# EasyEDA schematic SCH_STEMI_XB3.0_LneFollower_2023-01-25.json
TITLE: STEMI XB3.0; REV: 1.0; Date: 2019-07-29; Sheet: 1/1; Drawn By: MAYADI; Company: STEMI ROBOTIKA
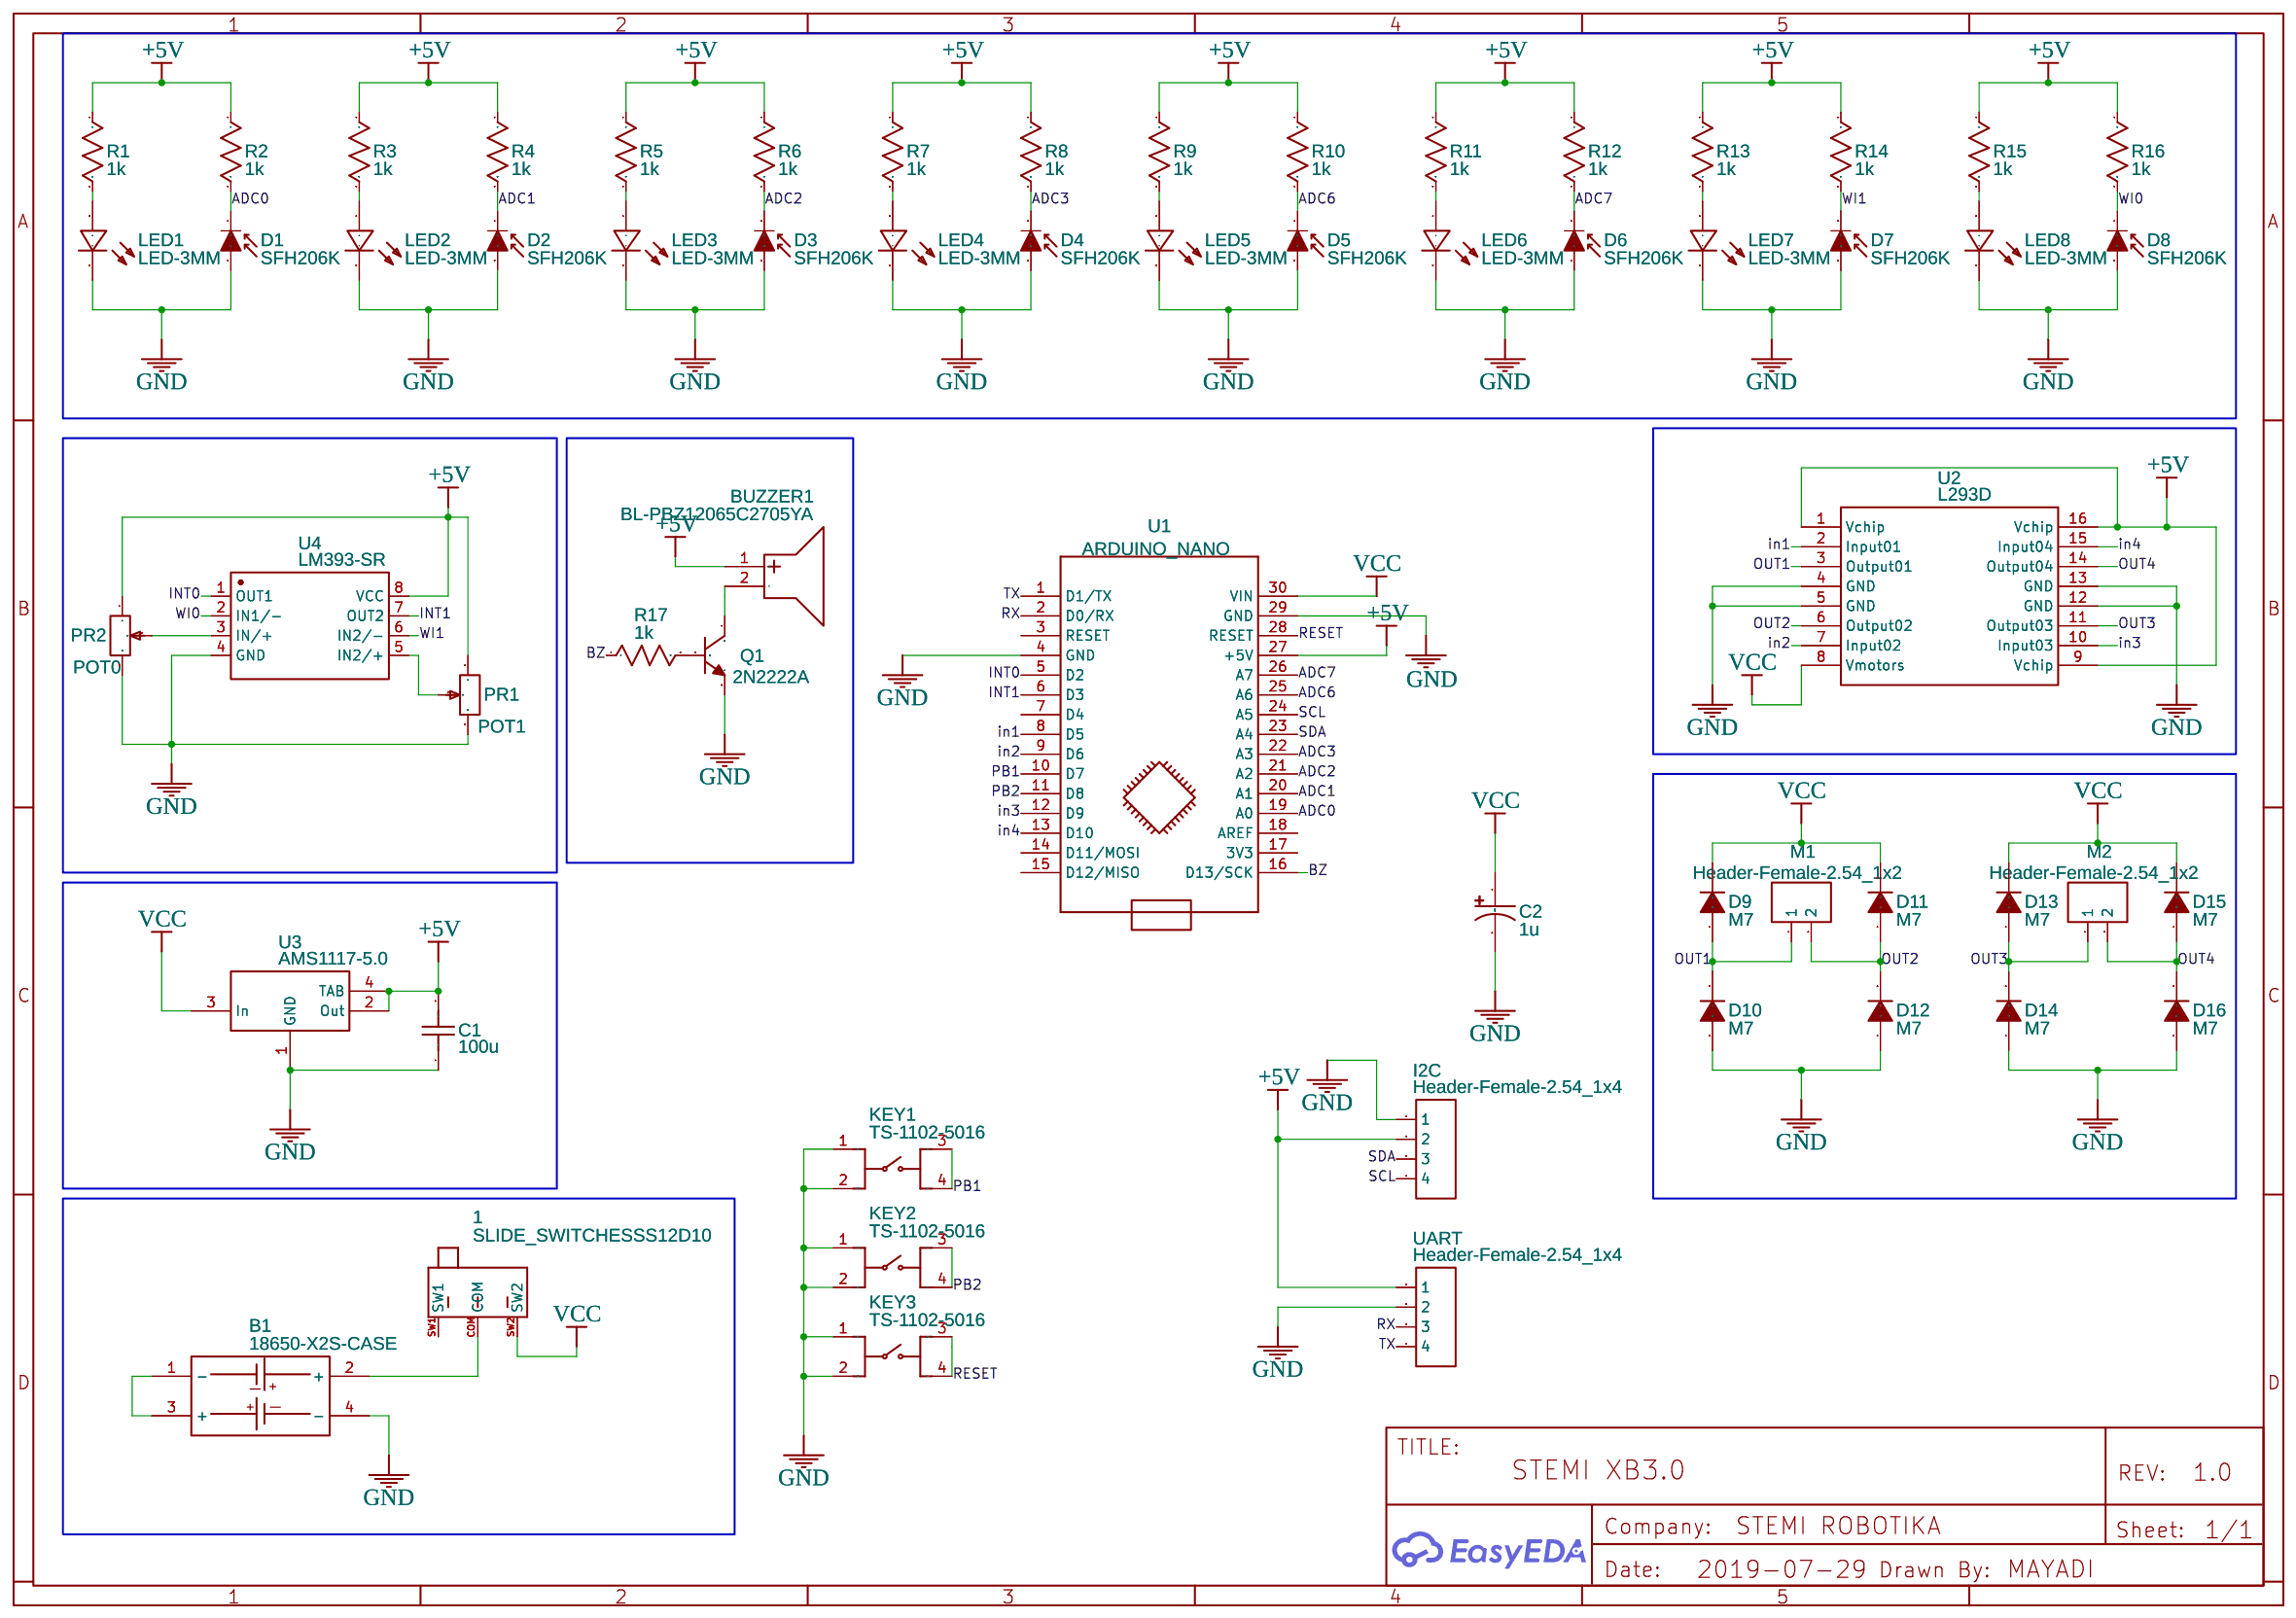
[diagram p0: schematic sheet]

## Parts
1  SLIDE_SWITCHESSS12D10  [SS12D10]
B1  18650-X2S-CASE  [18650-X2S]
BUZZER1  BL-PBZ12065C2705YA  [BUZZER-R6.0-2P-6.5PITCH]
C1  100u  [1206]
C2  1u  [CAP-D6.3XF2.5]
D1  SFH206K  [PHOTODIODE_SFH225]
D2  SFH206K  [PHOTODIODE_SFH225]
D3  SFH206K  [PHOTODIODE_SFH225]
D4  SFH206K  [PHOTODIODE_SFH225]
D5  SFH206K  [PHOTODIODE_SFH225]
D6  SFH206K  [PHOTODIODE_SFH225]
D7  SFH206K  [PHOTODIODE_SFH225]
D8  SFH206K  [PHOTODIODE_SFH225]
D9  M7  [SMB(DO-214AA)]
D10  M7  [SMB(DO-214AA)]
D11  M7  [SMB(DO-214AA)]
D12  M7  [SMB(DO-214AA)]
D13  M7  [SMB(DO-214AA)]
D14  M7  [SMB(DO-214AA)]
D15  M7  [SMB(DO-214AA)]
D16  M7  [SMB(DO-214AA)]
I2C  Header-Female-2.54_1x4  [HDR-4X1/2.54]
KEY1  TS-1102-5016  [KEY-6.0*6.0-2]
KEY2  TS-1102-5016  [KEY-6.0*6.0-2]
KEY3  TS-1102-5016  [KEY-6.0*6.0-2]
LED1  LED-3MM  [LED-3MM/2.54]
LED2  LED-3MM  [LED-3MM/2.54]
LED3  LED-3MM  [LED-3MM/2.54]
LED4  LED-3MM  [LED-3MM/2.54]
LED5  LED-3MM  [LED-3MM/2.54]
LED6  LED-3MM  [LED-3MM/2.54]
LED7  LED-3MM  [LED-3MM/2.54]
LED8  LED-3MM  [LED-3MM/2.54]
M1  Header-Female-2.54_1x2  [HDR-1X2/2.54]
M2  Header-Female-2.54_1x2  [HDR-1X2/2.54]
PR1  POT1  [RES-ADJ_3296W]
PR2  POT0  [RES-ADJ_3296W]
Q1  2N2222A  [TO-92(TO-92-3F)-2.54]
R1  1k  [AXIAL-0.4]
R2  1k  [AXIAL-0.4]
R3  1k  [AXIAL-0.4]
R4  1k  [AXIAL-0.4]
R5  1k  [AXIAL-0.4]
R6  1k  [AXIAL-0.4]
R7  1k  [AXIAL-0.4]
R8  1k  [AXIAL-0.4]
R9  1k  [AXIAL-0.4]
R10  1k  [AXIAL-0.4]
R11  1k  [AXIAL-0.4]
R12  1k  [AXIAL-0.4]
R13  1k  [AXIAL-0.4]
R14  1k  [AXIAL-0.4]
R15  1k  [AXIAL-0.4]
R16  1k  [AXIAL-0.4]
R17  1k  [AXIAL-0.4]
U1  ARDUINO_NANO  [ARDUINO_NANO]
U2  L293D  [MCP3008-IP]
U3  AMS1117-5.0  [SOT-223]
U4  LM393-SR  [SOIC-8_150MIL]
UART  Header-Female-2.54_1x4  [HDR-4X1/2.54]

## Library data of the parts
1 = -: Contributor: Thore Krug; Manufacturer Part: ?
B1 = -: Contributor: pyfa1992
BUZZER1 = -: Supplier: LCSC; Supplier Part: C249440; Manufacturer: Dongguan Bolin Elec; Contributor: LCSC
C1 = Cap_1206_US: Manufacturer Part: ?
C2 = Cap_Electrolytic(TH)_D6.3XF2.5_US: Manufacturer Part: ?
D1-D8 = -: Contributor: KiCAD; license: https://www.gnu.org/licenses/lgpl-2.1.html; Manufacturer Part: ?
D9-D16 = -: Supplier Part: undefined; Supplier: LCSC; Manufacturer: LCSC
I2C UART = -: Supplier: LCSC; Manufacturer: ReliaPro; Supplier Part: C124413
KEY1-KEY3 = -: Supplier: LCSC; Manufacturer: SOFNG; Contributor: EasyEDA; Supplier Part: C111609
LED1-LED8 = -: Supplier: LCSC; Manufacturer: EVERLIGHT; Manufacturer Part: 204-10SURD/S530-A3; Supplier Part: C99772
M1 M2 = -: Supplier: LCSC; Manufacturer: BOOMELE; Manufacturer Part: 2.54-1*2PFemale; image: //image.lceda.cn/szlcsc/C49661.jpg; Supplier Part: C49661
PR1 PR2 = -: Supplier Part: C62174; Supplier: LCSC; Manufacturer: ReliaPro; Manufacturer Part: Precision adjustable resistance 3296W-1-304(300K); image: http://image.lceda.cn/szlcsc/C62174.jpg
Q1 = -: Supplier: LCSC; Supplier Part: C358533; Manufacturer: Foshan Blue Rocket Elec; Contributor: LCSC
R1-R17 = Res_AXIAL-0.4(1/4W)_US: Manufacturer Part: ?
U1 = -: sourceId: KGSeAWhDB; Manufacturer Part: ?
U2 = -: Contributor: Cameron_Roy; Supplier Part: C12340; Supplier: LCSC; Manufacturer: STMicroelectronics; image: //image.lceda.cn/szlcsc/C12340.jpg
U3 = -: sourceId: HltLFyQwq; Supplier: LCSC; Manufacturer: AMS; LCSC Assembly: Yes; image: //image.lceda.cn/szlcsc/C6187.jpg; Supplier Part: C6187; SMT Type: Basic
U4 = -: Supplier: LCSC; Manufacturer: 3PEAK; Supplier Part: C93150; LCSC Assembly: Yes; SMT Type: Extend

## Nets
+5V: BUZZER1.1(+) C1.2 I2C.2 PR1.1 PR2.1 R1.1 R2.1 R3.1 R4.1 R5.1 R6.1 R7.1 R8.1 R9.1 R10.1 R11.1 R12.1 R13.1 R14.1 R15.1 R16.1 U1.27(+5V) U2.1(Vchip) U2.9(Vchip) U2.16(Vchip) U3.2(Out) U3.4(TAB) U4.8(VCC) UART.1
GND: B1.4(-) C1.1 C2.2 D1.2(A) D2.2(A) D3.2(A) D4.2(A) D5.2(A) D6.2(A) D7.2(A) D8.2(A) D10.1(A) D12.1(A) D14.1(A) D16.1(A) I2C.1 KEY1.1 KEY1.2 KEY2.1 KEY2.2 KEY3.1 KEY3.2 LED1.2(-) LED2.2(-) LED3.2(-) LED4.2(-) LED5.2(-) LED6.2(-) LED7.2(-) LED8.2(-) PR1.3 PR2.3 Q1.3(E) U1.4(GND) U1.29(GND) U2.4(GND) U2.5(GND) U2.12(GND) U2.13(GND) U3.1(GND) U4.4(GND) UART.2
VCC: 1.SW2 C2.1 D9.2(K) D11.2(K) D13.2(K) D15.2(K) U1.30(VIN) U2.8(Vmotors) U3.3(In)
ADC0: D1.1(K) R2.2 U1.19(A0)
ADC1: D2.1(K) R4.2 U1.20(A1)
ADC2: D3.1(K) R6.2 U1.21(A2)
ADC3: D4.1(K) R8.2 U1.22(A3)
ADC6: D5.1(K) R10.2 U1.25(A6)
ADC7: D6.1(K) R12.2 U1.26(A7)
BZ: R17.1 U1.16(D13/SCK)
in1: U1.8(D5) U2.2(Input01)
in2: U1.9(D6) U2.7(Input02)
in3: U1.12(D9) U2.10(Input03)
in4: U1.13(D10) U2.15(Input04)
INT0: U1.5(D2) U4.1(OUT1)
INT1: U1.6(D3) U4.7(OUT2)
OUT1: D9.1(A) D10.2(K) M1.1 U2.3(Output01)
OUT2: D11.1(A) D12.2(K) M1.2 U2.6(Output02)
OUT3: D13.1(A) D14.2(K) M2.1 U2.11(Output03)
OUT4: D15.1(A) D16.2(K) M2.2 U2.14(Output04)
PB1: KEY1.3 KEY1.4 U1.10(D7)
PB2: KEY2.3 KEY2.4 U1.11(D8)
RESET: KEY3.3 KEY3.4 U1.28(RESET)
RX: U1.2(D0/RX) UART.3
SCL: I2C.4 U1.24(A5)
SDA: I2C.3 U1.23(A4)
TX: U1.1(D1/TX) UART.4
WI0: D8.1(K) R16.2 U4.2(IN1/-)
WI1: D7.1(K) R14.2 U4.6(IN2/-)
Net-(1-COM): 1.COM B1.2(+)
Net-(B1-1): B1.1(-) B1.3(+)
Net-(BUZZER1-2): BUZZER1.2(-) Q1.1(C)
Net-(LED1-1): LED1.1(+) R1.2
Net-(LED2-1): LED2.1(+) R3.2
Net-(LED3-1): LED3.1(+) R5.2
Net-(LED4-1): LED4.1(+) R7.2
Net-(LED5-1): LED5.1(+) R9.2
Net-(LED6-1): LED6.1(+) R11.2
Net-(LED7-1): LED7.1(+) R13.2
Net-(LED8-1): LED8.1(+) R15.2
Net-(PR1-2): PR1.2 U4.5(IN2/+)
Net-(PR2-2): PR2.2 U4.3(IN/+)
Net-(Q1-2): Q1.2(B) R17.2

Not connected (* = marked no-connect by the designer): 1 SW1; U1 3(RESET) 7(D4) 14(D11/MOSI) 15(D12/MISO) 17(3V3) 18(AREF)
